# EAGLE design DP_eDP_Adapter_v1.1 (EAGLE 6.4)

## Sheet 1 of 3
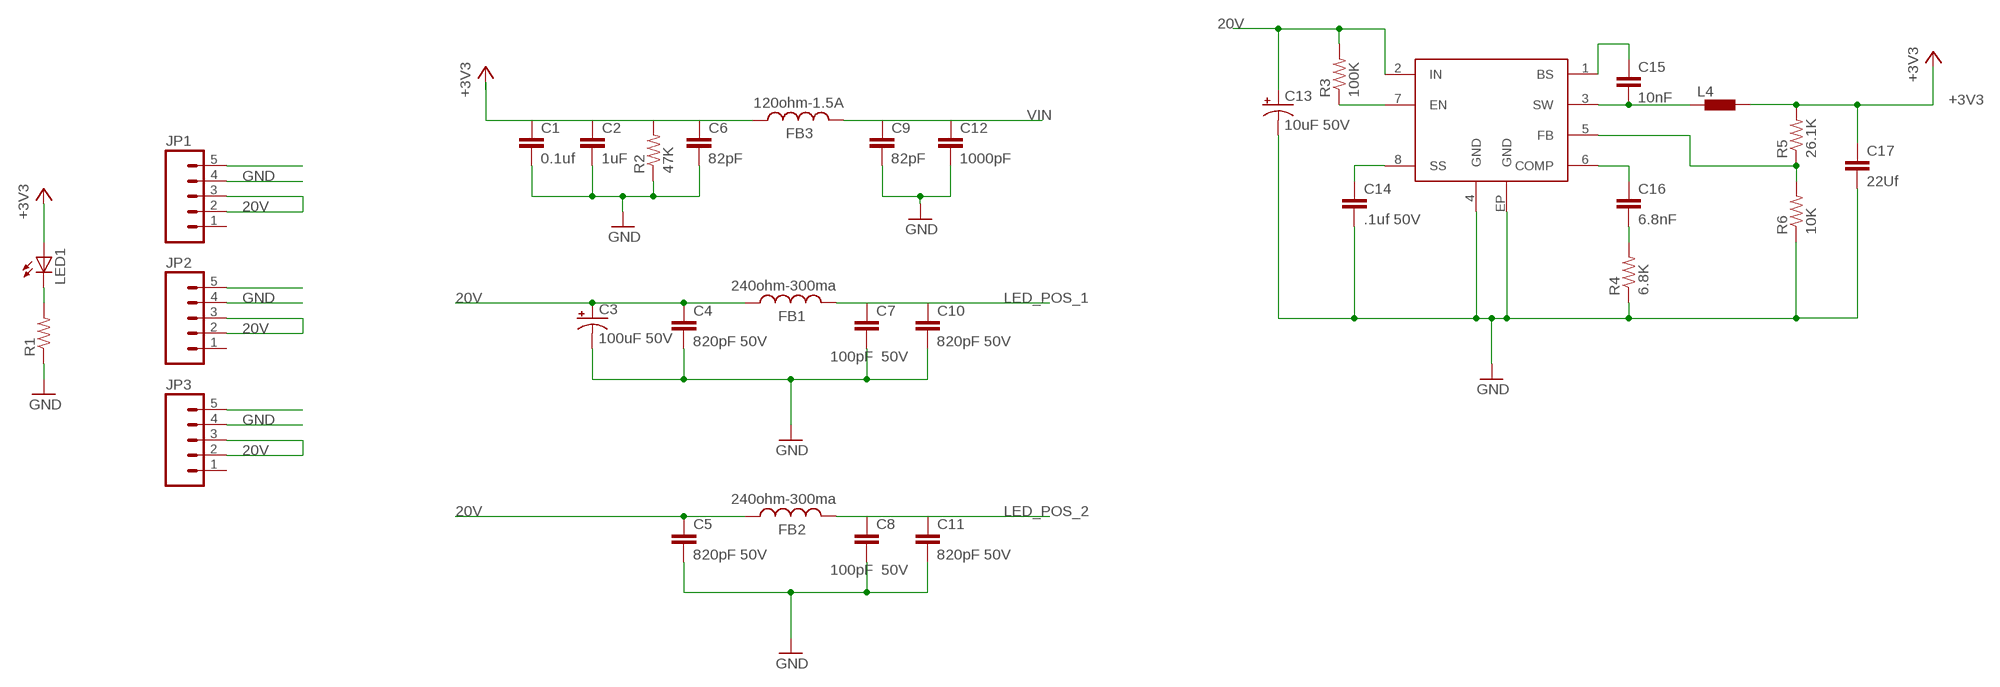
[diagram p0: schematic, sheet 1]

### Parts
C1  0.1uf  CAP0402-CAP  [0402-CAP]
C2  1uF  CAP0402-CAP  [0402-CAP]
C3  100uF 50V  CAP_POL6032  [EIA6032]
C4  820pF 50V  CAP0402-CAP  [0402-CAP]
C5  820pF 50V  CAP0402-CAP  [0402-CAP]
C6  82pF  CAP0402-CAP  [0402-CAP]
C7  100pF 50V  CAP0402-CAP  [0402-CAP]
C8  100pF 50V  CAP0402-CAP  [0402-CAP]
C9  82pF  CAP0402-CAP  [0402-CAP]
C10  820pF 50V  CAP0402-CAP  [0402-CAP]
C11  820pF 50V  CAP0402-CAP  [0402-CAP]
C12  1000pF  CAP0402-CAP  [0402-CAP]
C13  10uF 50V  CAP_POL6032  [EIA6032]
C14  .1uf 50V  CAP0402-CAP  [0402-CAP]
C15  10nF  CAP1206  [1206]
C16  6.8nF  CAP0402-CAP  [0402-CAP]
C17  22Uf  CAP0402-CAP  [0402-CAP]
FB1  240ohm-300ma  L-US  [R0402]
FB2  240ohm-300ma  L-US  [R0402]
FB3  120ohm-1.5A  L-US  [R0402]
IC1  AP6502A  [SO8-EP]
JP1  M05PTH  [1X05]
JP2  M05PTH  [1X05]
JP3  M05PTH  [1X05]
L4  INDUCTORS_DR10300520C  [0520C]
LED1  LED_LEDCHIPLED_1206  [LED_CHIPLED_1206]
R1  RESISTOR0402-RES  [0402-RES]
R2  47K  RESISTOR0402-RES  [0402-RES]
R3  100K  RESISTOR0402-RES  [0402-RES]
R4  6.8K  RESISTOR0402-RES  [0402-RES]
R5  26.1K  RESISTOR0402-RES  [0402-RES]
R6  10K  RESISTOR0402-RES  [0402-RES]

### Nets
20V [Power]: C3.P$1(+) C4.1 C5.1 C13.P$1(+) FB1.1 FB2.1 IC1.2(IN) JP1.2 JP1.3 JP2.2 JP2.3 JP3.2 JP3.3 R3.2
+3V3: C1.1 C2.1 C6.1 C17.1 FB3.1 L4.P$2 LED1.A R2.2 R5.2 ; also sheet 2,3
GND: C1.2 C2.2 C3.P$2(-) C4.2 C5.2 C6.2 C7.2 C8.2 C9.2 C10.2 C11.2 C12.2 C13.P$2(-) C14.2 C17.2 IC1.4(GND) IC1.EP(GND) JP1.4 JP1.5 JP2.4 JP2.5 JP3.4 JP3.5 R1.1 R2.1 R4.1 R6.1 ; also sheet 2,3
LED_POS_1: C7.1 C10.1 FB1.2 ; also sheet 3
LED_POS_2: C8.1 C11.1 FB2.2 ; also sheet 3
N$2: IC1.7(EN) R3.1
N$3: LED1.C R1.2
N$7: C14.1 IC1.8(SS)
N$8: C16.1 IC1.6(COMP)
N$9: C16.2 R4.2
N$10: IC1.5(FB) R5.1 R6.2
N$14: C15.2 IC1.3(SW) L4.P$1
N$18: C15.1 IC1.1(BS)
VIN: C9.1 C12.1 FB3.2 ; also sheet 3
Unconnected: JP1.1 JP2.1 JP3.1

## Sheet 2 of 3
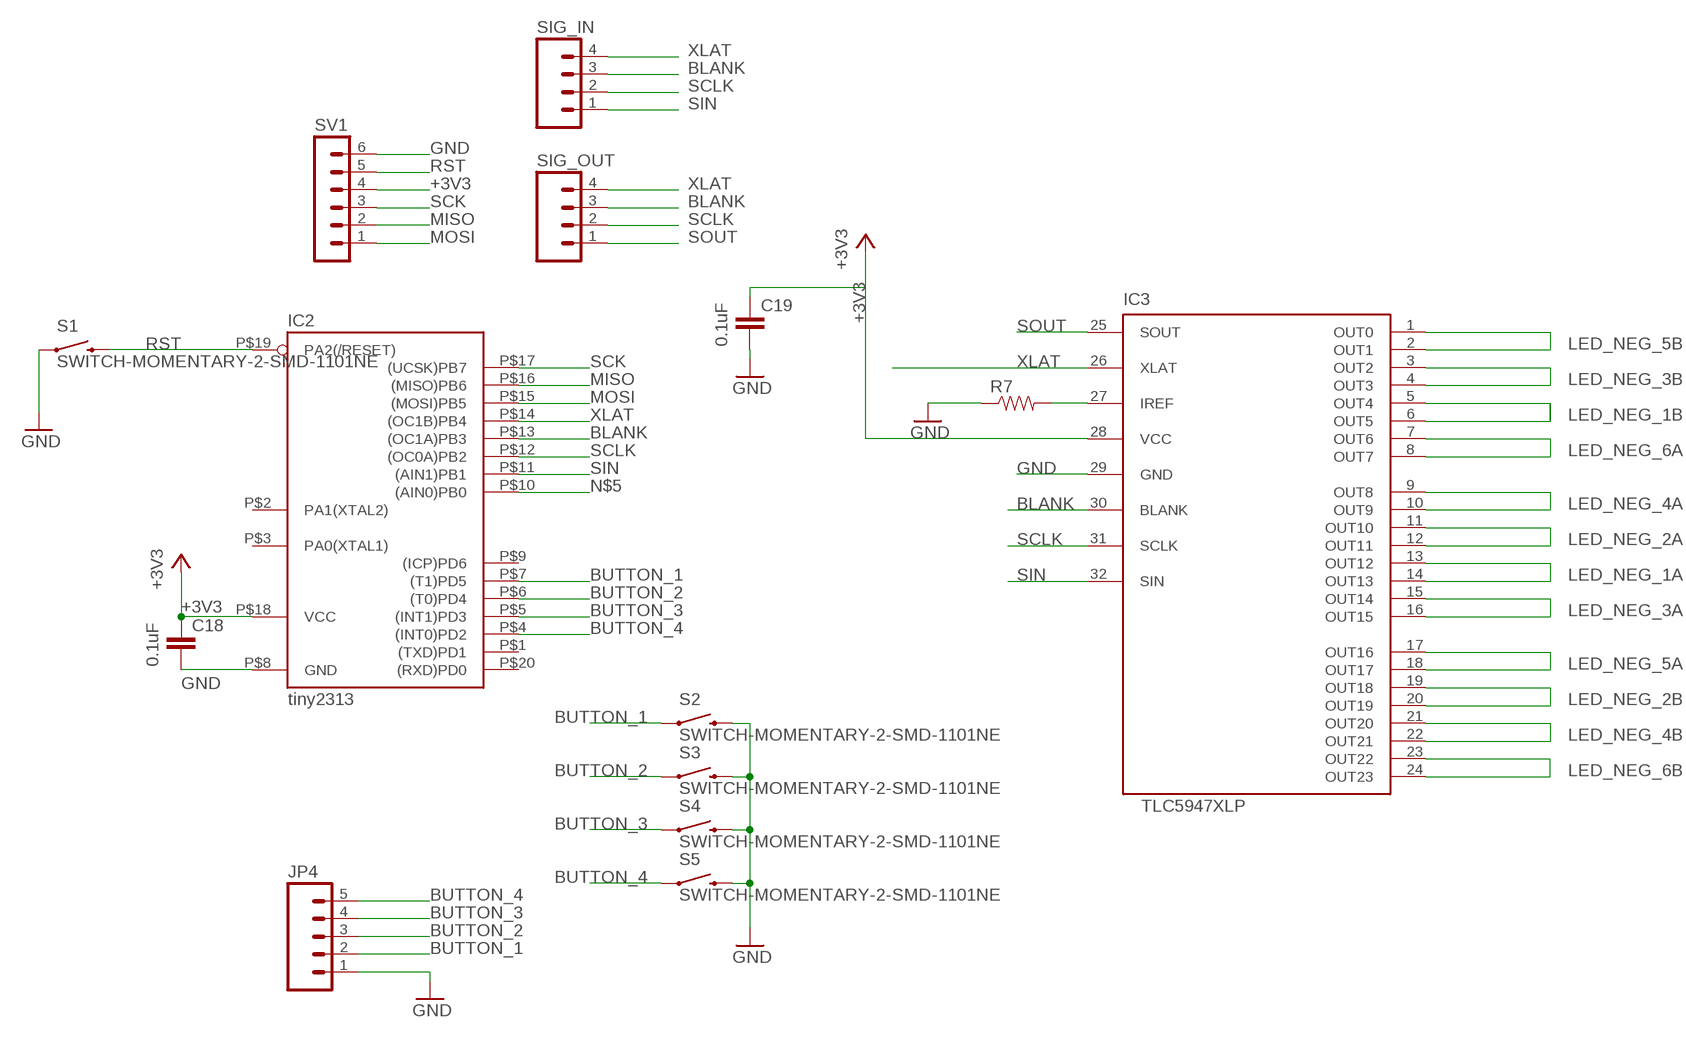
[diagram p1: schematic, sheet 2]

### Parts
C18  0.1uF  CAP0402-CAP  [0402-CAP]
C19  0.1uF  CAP0402-CAP  [0402-CAP]
IC2  tiny2313  TINY2313-*M*  [MLF20]
IC3  TLC5947XLP  [QFN32_XLP]
JP4  M05PTH  [1X05]
R7  RESISTOR0402-RES  [0402-RES]
S1  SWITCH-MOMENTARY-2-SMD-1101NE  [TACTILE-SWITCH-1101NE]
S2  SWITCH-MOMENTARY-2-SMD-1101NE  [TACTILE-SWITCH-1101NE]
S3  SWITCH-MOMENTARY-2-SMD-1101NE  [TACTILE-SWITCH-1101NE]
S4  SWITCH-MOMENTARY-2-SMD-1101NE  [TACTILE-SWITCH-1101NE]
S5  SWITCH-MOMENTARY-2-SMD-1101NE  [TACTILE-SWITCH-1101NE]
SIG_IN  M04PTH  [1X04]
SIG_OUT  M04PTH  [1X04]
SV1  MA06-1  [MA06-1]

### Nets
+3V3: C18.1 C19.1 IC2.P$18(VCC) IC3.28(VCC) SV1.4 ; also sheet 1,3
BLANK: IC2.P$13((OC1A)PB3) IC3.30(BLANK) SIG_IN.3 SIG_OUT.3
BUTTON_1: IC2.P$7((T1)PD5) JP4.2 S2.P$1
BUTTON_2: IC2.P$6((T0)PD4) JP4.3 S3.P$1
BUTTON_3: IC2.P$5((INT1)PD3) JP4.4 S4.P$1
BUTTON_4: IC2.P$4((INT0)PD2) JP4.5 S5.P$1
GND: C18.2 C19.2 IC2.P$8(GND) IC3.29(GND) JP4.1 R7.1 S1.P$1 S2.P$2 S3.P$2 S4.P$2 S5.P$2 SV1.6 ; also sheet 1,3
LED_NEG_1A: IC3.13(OUT12) IC3.14(OUT13) ; also sheet 3
LED_NEG_1B: IC3.5(OUT4) IC3.6(OUT5) ; also sheet 3
LED_NEG_2A: IC3.11(OUT10) IC3.12(OUT11) ; also sheet 3
LED_NEG_2B: IC3.19(OUT18) IC3.20(OUT19) ; also sheet 3
LED_NEG_3A: IC3.15(OUT14) IC3.16(OUT15) ; also sheet 3
LED_NEG_3B: IC3.3(OUT2) IC3.4(OUT3) ; also sheet 3
LED_NEG_4A: IC3.9(OUT8) IC3.10(OUT9) ; also sheet 3
LED_NEG_4B: IC3.21(OUT20) IC3.22(OUT21) ; also sheet 3
LED_NEG_5A: IC3.17(OUT16) IC3.18(OUT17) ; also sheet 3
LED_NEG_5B: IC3.1(OUT0) IC3.2(OUT1) ; also sheet 3
LED_NEG_6A: IC3.7(OUT6) IC3.8(OUT7) ; also sheet 3
LED_NEG_6B: IC3.23(OUT22) IC3.24(OUT23) ; also sheet 3
MISO: IC2.P$16((MISO)PB6) SV1.2
MOSI: IC2.P$15((MOSI)PB5) SV1.1
N$5: IC2.P$10((AIN0)PB0)
N$13: IC3.27(IREF) R7.2
RST: IC2.P$19(PA2(/RESET)) S1.P$2 SV1.5
SCK: IC2.P$17((UCSK)PB7) SV1.3
SCLK: IC2.P$12((OC0A)PB2) IC3.31(SCLK) SIG_IN.2 SIG_OUT.2
SIN: IC2.P$11((AIN1)PB1) IC3.32(SIN) SIG_IN.1
SOUT: IC3.25(SOUT) SIG_OUT.1
XLAT: IC2.P$14((OC1B)PB4) IC3.26(XLAT) SIG_IN.4 SIG_OUT.4
Unconnected: IC2.P$1((TXD)PD1) IC2.P$2(PA1(XTAL2)) IC2.P$3(PA0(XTAL1)) IC2.P$9((ICP)PD6) IC2.P$20((RXD)PD0)

## Sheet 3 of 3
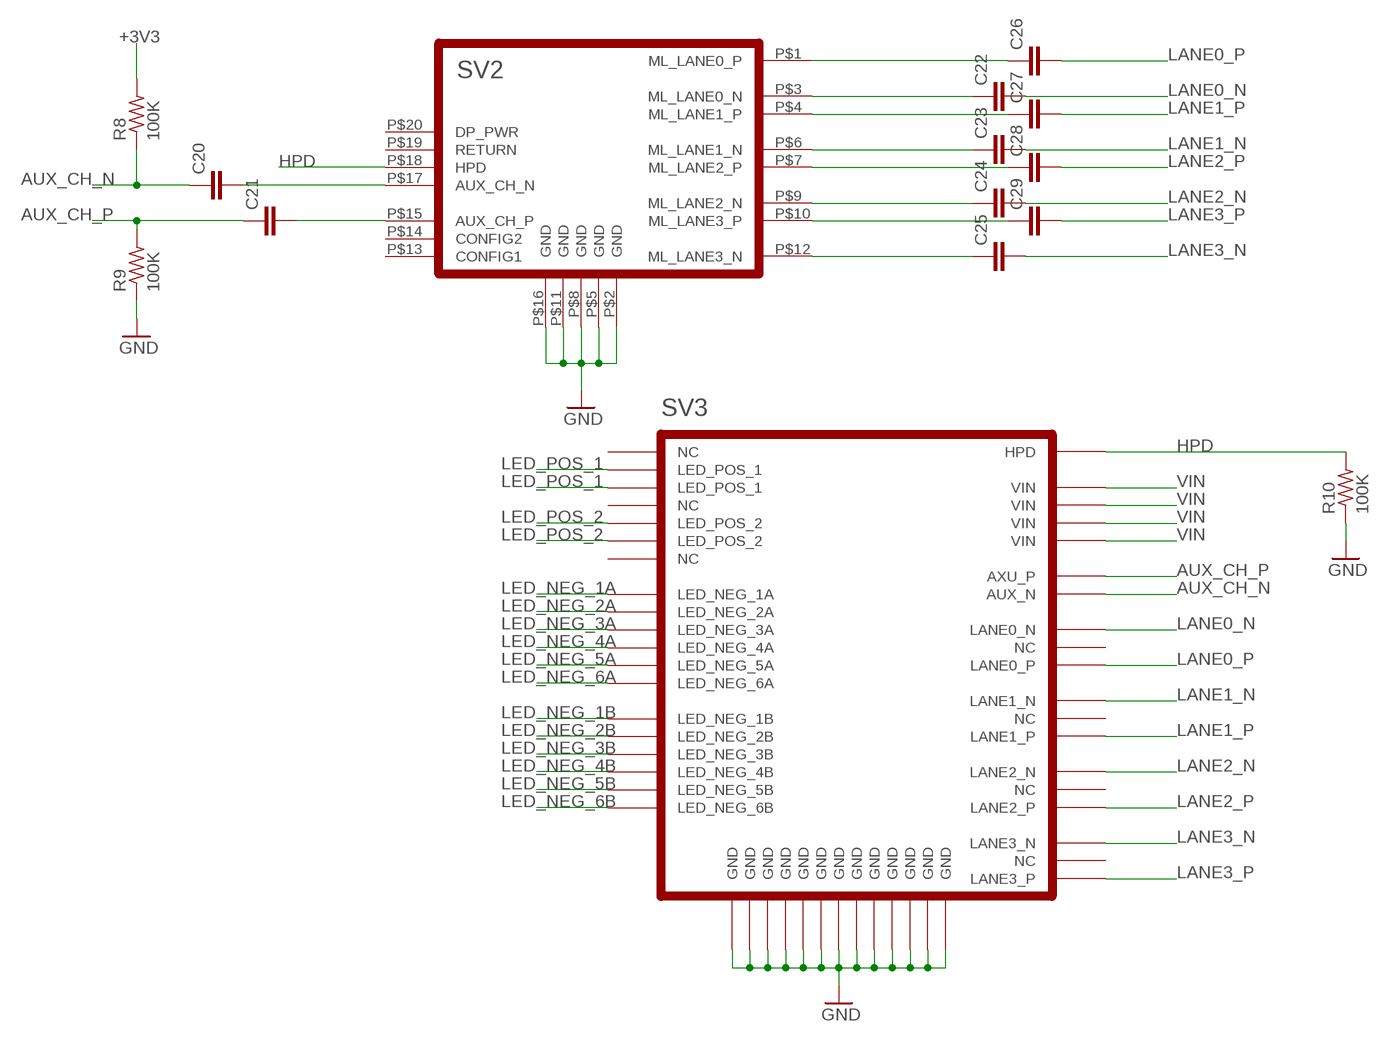
[diagram p2: schematic, sheet 3]

### Parts
C20  SPARKFUN-PASSIVES_CAP0402-CAP  [SPARKFUN-PASSIVES_0402-CAP]
C21  SPARKFUN-PASSIVES_CAP0402-CAP  [SPARKFUN-PASSIVES_0402-CAP]
C22  SPARKFUN-PASSIVES_CAP0402-CAP  [SPARKFUN-PASSIVES_0402-CAP]
C23  SPARKFUN-PASSIVES_CAP0402-CAP  [SPARKFUN-PASSIVES_0402-CAP]
C24  SPARKFUN-PASSIVES_CAP0402-CAP  [SPARKFUN-PASSIVES_0402-CAP]
C25  SPARKFUN-PASSIVES_CAP0402-CAP  [SPARKFUN-PASSIVES_0402-CAP]
C26  SPARKFUN-PASSIVES_CAP0402-CAP  [SPARKFUN-PASSIVES_0402-CAP]
C27  SPARKFUN-PASSIVES_CAP0402-CAP  [SPARKFUN-PASSIVES_0402-CAP]
C28  SPARKFUN-PASSIVES_CAP0402-CAP  [SPARKFUN-PASSIVES_0402-CAP]
C29  SPARKFUN-PASSIVES_CAP0402-CAP  [SPARKFUN-PASSIVES_0402-CAP]
R8  100K  R-US_R0402  [R0402]
R9  100K  R-US_R0402  [R0402]
R10  100K  R-US_R0402  [R0402]
SV2  DP1RD20JQ2R400  [DP_REVERSE_JAE]
SV3  DP_EDP_ADAPTER_EDP_CONNECTOR  [DP_EDP_ADAPTER_EDP_MOLEX]

### Nets
+3V3: R8.2 ; also sheet 1,2
AUX_CH_N: C20.1 R8.1 SV3.P$10(AUX_N)
AUX_CH_P: C21.1 R9.2 SV3.P$9(AXU_P)
AUX_N: C20.2 SV2.P$17(AUX_CH_N)
AUX_P: C21.2 SV2.P$15(AUX_CH_P)
GND: R9.1 R10.1 SV2.P$2(GND) SV2.P$5(GND) SV2.P$8(GND) SV2.P$11(GND) SV2.P$16(GND) SV3.P$1(GND) SV3.P$3(GND) SV3.P$8(GND) SV3.P$11(GND) SV3.P$15(GND) SV3.P$19(GND) SV3.P$23(GND) SV3.P$27(GND) SV3.P$28(GND) SV3.P$29(GND) SV3.P$36(GND) SV3.P$43(GND) SV3.P$51(GND) ; also sheet 1,2
HPD: R10.2 SV2.P$18(HPD) SV3.P$2(HPD)
LANE0_N: C22.2 SV3.P$12(LANE0_N)
LANE0_P: C26.2 SV3.P$14(LANE0_P)
LANE1_N: C23.2 SV3.P$16(LANE1_N)
LANE1_P: C27.2 SV3.P$18(LANE1_P)
LANE2_N: C24.2 SV3.P$20(LANE2_N)
LANE2_P: C28.2 SV3.P$22(LANE2_P)
LANE3_N [DP]: C25.2 SV3.P$24(LANE3_N)
LANE3_P [DP]: C29.2 SV3.P$26(LANE3_P)
LED_NEG_1A: SV3.P$42(LED_NEG_1A) ; also sheet 2
LED_NEG_1B: SV3.P$35(LED_NEG_1B) ; also sheet 2
LED_NEG_2A: SV3.P$41(LED_NEG_2A) ; also sheet 2
LED_NEG_2B: SV3.P$34(LED_NEG_2B) ; also sheet 2
LED_NEG_3A: SV3.P$40(LED_NEG_3A) ; also sheet 2
LED_NEG_3B: SV3.P$33(LED_NEG_3B) ; also sheet 2
LED_NEG_4A: SV3.P$39(LED_NEG_4A) ; also sheet 2
LED_NEG_4B: SV3.P$32(LED_NEG_4B) ; also sheet 2
LED_NEG_5A: SV3.P$38(LED_NEG_5A) ; also sheet 2
LED_NEG_5B: SV3.P$31(LED_NEG_5B) ; also sheet 2
LED_NEG_6A: SV3.P$37(LED_NEG_6A) ; also sheet 2
LED_NEG_6B: SV3.P$30(LED_NEG_6B) ; also sheet 2
LED_POS_1: SV3.P$48(LED_POS_1) SV3.P$49(LED_POS_1) ; also sheet 1
LED_POS_2: SV3.P$45(LED_POS_2) SV3.P$46(LED_POS_2) ; also sheet 1
N$3_N [DP]: C22.1 SV2.P$3(ML_LANE0_N)
N$3_P [DP]: C26.1 SV2.P$1(ML_LANE0_P)
N$15_N [DP]: C23.1 SV2.P$6(ML_LANE1_N)
N$15_P [DP]: C27.1 SV2.P$4(ML_LANE1_P)
N$17_N [DP]: C24.1 SV2.P$9(ML_LANE2_N)
N$17_P [DP]: C28.1 SV2.P$7(ML_LANE2_P)
N$19_N [DP]: C25.1 SV2.P$12(ML_LANE3_N)
N$19_P [DP]: C29.1 SV2.P$10(ML_LANE3_P)
VIN: SV3.P$4(VIN) SV3.P$5(VIN) SV3.P$6(VIN) SV3.P$7(VIN) ; also sheet 1
Unconnected: SV2.P$13(CONFIG1) SV2.P$14(CONFIG2) SV2.P$19(RETURN) SV2.P$20(DP_PWR) SV3.P$13(NC) SV3.P$17(NC) SV3.P$21(NC) SV3.P$25(NC) SV3.P$44(NC) SV3.P$47(NC) SV3.P$50(NC)

## Library data of the parts
C1 C2 C4-C12 C14-C17 = SparkFun-Passives:CAP: Capacitor Standard 0603 ceramic capacitor, and 0.1" leaded capacitor.
C3 C13 = SparkFun-Passives:CAP_POL: Capacitor Polarized These are standard SMD and PTH capacitors. Normally 10uF, 47uF, and 100uF in electrolytic and tantalum varieties. Always verify the external diameter of the through hole cap, it varies with capacity, voltage, and manufacturer. The EIA devices should be standard.
C18 C19 = SparkFun:CAP: Capacitor Standard 0603 ceramic capacitor, and 0.1" leaded capacitor.
C20-C29 = DP_eDP_Adapter:SPARKFUN-PASSIVES_CAP: Capacitor Standard 0603 ceramic capacitor, and 0.1" leaded capacitor.
FB1-FB3 = rcl:L-US: INDUCTOR, American symbol
IC1 = DP_eDP_Adapter:AP6502A
IC2 = NSL_Cylon:TINY2313*: Atmel Tiny2313 2K Flash, 128 bytes EEPROM, 128 bytes RAM
IC3 = slice_noshift:TLC5947
JP1-JP4 = SparkFun-Connectors:M05: Header 5 Standard 5-pin 0.1" header. Use with straight break away headers (SKU : PRT-00116), right angle break away headers (PRT-00553), swiss pins (PRT-00743), machine pins (PRT-00117), and female headers (PRT-00115). Molex polarized connector foot print use with SKU : PRT-08230 with associated crimp pins and housings.
L4 = DP_eDP_Adapter_v1.1:INDUCTORS_DR1030: DR1030 Series Low Profile Power Inductors Source: Data sheet <http://www.cooperbussmann.com/pdf/c73e479f-f867-4c64-ae26-9c1f23814163.pdf>
LED1 = badge.lbrbadge_2013:LED_LED: LED OSRAM: - CHIPLED LG R971, LG N971, LY N971, LG Q971, LY Q971, LO R971, LY R971 LH N974, LH R974 LS Q976, LO Q976, LY Q976 LO Q996 - Hyper CHIPLED LW Q18S LB Q993, LB Q99A, LB R99A - SideLED LS A670, LO A670, LY A670, LG A670, LP A670 LB A673, LV A673, LT A673, LW A673 LH A674 LY A675 LS A676, LA A676, LO A676, LY A676, LW A676 LS A679, LY A679, LG A679 - Hyper Micro SIDELED® LS Y876, LA Y876, LO Y876, LY Y876 LT Y87S - SmartLED LW L88C, LW L88S LB L89C, LB L89S, LG L890 LS L89K, LO L89K, LY L89K LS L896, LA L896, LO L896, LY L896 - TOPLED LS T670, LO T670, LY T670, LG T670, LP T670 LSG T670, LSP T670, LSY T670, LOP T670, LYG T670 LG T671, LOG T671, LSG T671 LB T673, LV T673, LT T673, LW T673 LH T674 LS T676, LA T676, LO T676, LY T676, LB T676, LH T676, LSB T676, LW T676 LB T67C, LV T67C, LT T67C, LS T67K, LO T67K, LY T67K, LW E67C LS E67B, LA E67B, LO E67B, LY E67B, LB E67C, LV E67C, LT E67C LW T67C LS T679, LY T679, LG T679 LS T770, LO T770, LY T770, LG T770, LP T770 LB T773, LV T773, LT T773, LW T773 LH T774 LS E675, LA E675, LY E675, LS T675 LS T776, LA T776, LO T776, LY T776, LB T776 LHGB T686 LT T68C, LB T68C - Hyper Mini TOPLED® LB M676 - Mini TOPLED Santana® LG M470 LS M47K, LO M47K, LY M47K Source: http://www.osram.convergy.de LUXEON: - LUMILED® LXK2-PW12-R00, LXK2-PW12-S00, LXK2-PW14-U00, LXK2-PW14-V00 LXK2-PM12-R00, LXK2-PM12-S00, LXK2-PM14-U00 LXK2-PE12-Q00, LXK2-PE12-R00, LXK2-PE12-S00, LXK2-PE14-T00, LXK2-PE14-U00 LXK2-PB12-K00, LXK2-PB12-L00, LXK2-PB12-M00, LXK2-PB14-N00, LXK2-PB14-P00, LXK2-PB14-Q00 LXK2-PR12-L00, LXK2-PR12-M00, LXK2-PR14-Q00, LXK2-PR14-R00 LXK2-PD12-Q00, LXK2-PD12-R00, LXK2-PD12-S00 LXK2-PH12-R00, LXK2-PH12-S00 LXK2-PL12-P00, LXK2-PL12-Q00, LXK2-PL12-R00 Source: www.luxeon.com KINGBRIGHT: KA-3528ASYC Source: www.kingbright.com
R1-R7 = SparkFun-Passives:RESISTOR: Resistor Basic schematic elements and footprints for 0603, 1206, and PTH resistors.
R8-R10 = rcl:R-US_: RESISTOR, American symbol
S1-S5 = SparkFun-Electromechanical:SWITCH-MOMENTARY-2: Various NO switches- pushbuttons, reed, etc
SIG_IN SIG_OUT = SparkFun-Connectors:M04: Header 4 Standard 4-pin 0.1" header. Use with straight break away headers (SKU : PRT-00116), right angle break away headers (PRT-00553), swiss pins (PRT-00743), machine pins (PRT-00117), and female headers (PRT-00115). Molex polarized connector foot print use with SKU : PRT-08231 with associated crimp pins and housings. 1MM SMD Version SKU: PRT-10208
SV1 = NSL:MA06-1: PIN HEADER
SV2 = DP_eDP_Adapter:DP1RD20JQ2R400
SV3 = DP_eDP_Adapter:DP_EDP_ADAPTER_EDP_CONNECTOR

## Net classes
0 default: width 0.203 mm
1 DP: width 0.203 mm, drill 0.305 mm, clearance 0.203 mm
2 Power: width 0.305 mm

## Board
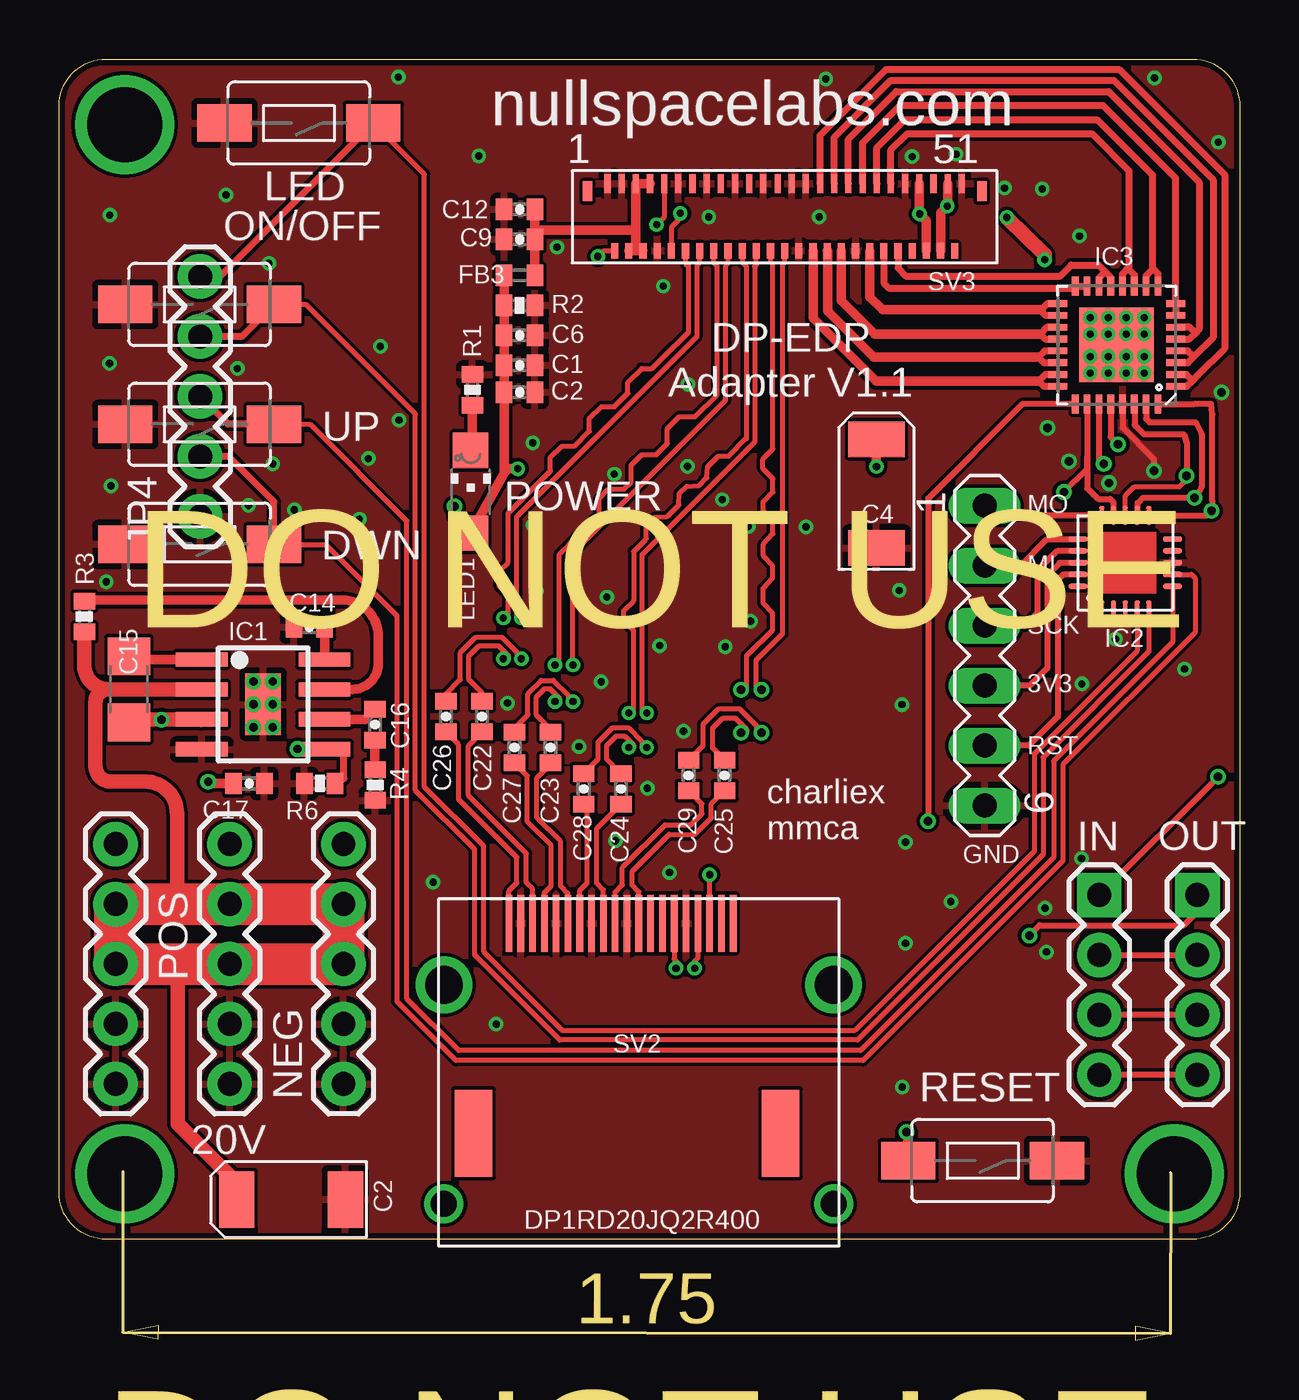
[diagram p3: board, top side]
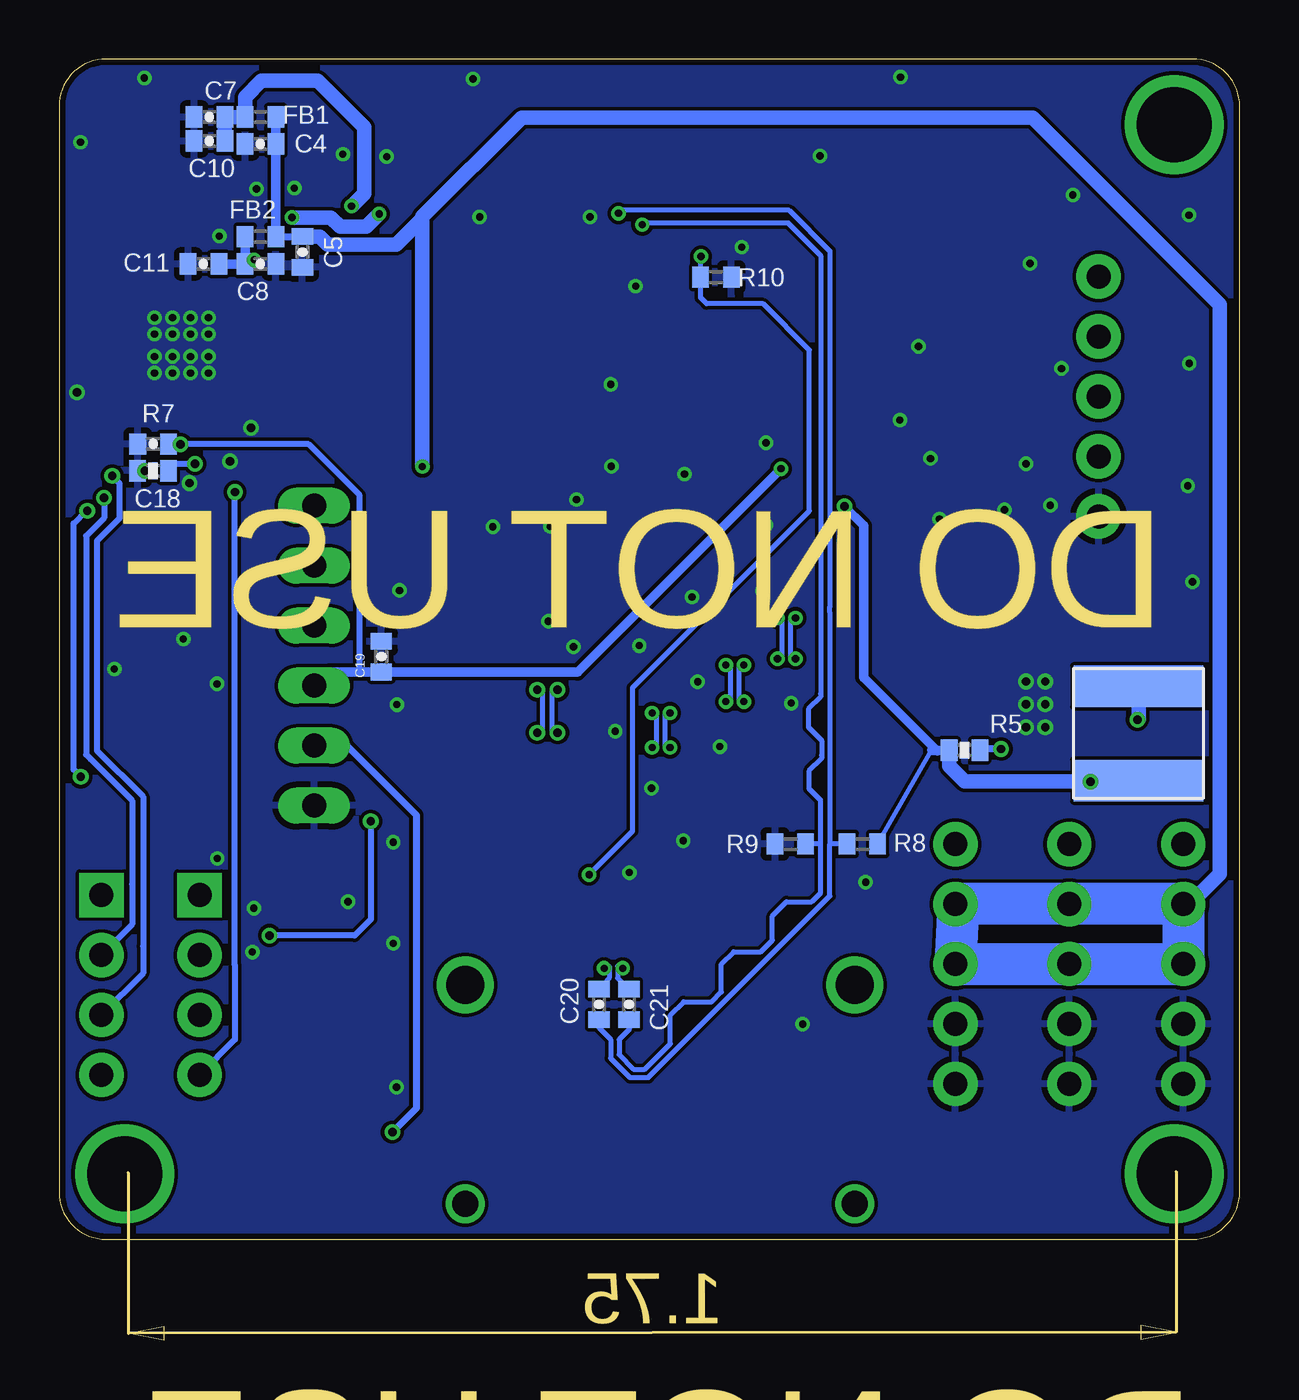
[diagram p4: board, bottom side, seen from below]

Size 50 x 50 mm. Coordinates in mm from the lower left corner, seen from the top.
Outline: 50,48 50,2 arc-90 48,0 2,0 arc-90 0,2 0,48 arc-90 2,50 48,50 arc-90 50,48
Copper layers (1*16): Top 0.035mm / dielectric 1.5mm / Bottom 0.035mm
Design rules "ITEADstudio_DRC *": minimum track width 6mil, minimum drill 12mil, track to track 6mil, track to pad 6mil, pad to pad 6mil, via to via 6mil, smd to smd 0mil, copper to edge 10mil, drill to drill 10mil, minimum pad ring 10mil, minimum via ring 6mil, stop-mask expansion 2mil, vias tented up to drill 20mil, thermal gap 10mil

### Footprints (pad centres in the part's own frame; a part is rotated, then mirrored left to right if it is on the bottom)
0402-CAP = smd 0.7 x 0.9: 1 -0.65,0; 2 0.65,0
EIA6032 = smd 1.5 x 2.4: P$1 -2.3,0; P$2 2.3,0
1206 = smd 1.6 x 1.8: 1 -1.4,0; 2 1.4,0
SPARKFUN-PASSIVES_0402-CAP = smd 0.7 x 0.9: 1 -0.65,0; 2 0.65,0
R0402 = smd 0.7 x 0.9: 1 -0.65,0; 2 0.65,0
SO8-EP = smd 2.2 x 0.6: 1 -2.6,1.905; 2 -2.6,0.635; 3 -2.6,-0.635; 4 -2.6,-1.905; 5 2.6,-1.905; 6 2.6,-0.635; 7 2.6,0.635; 8 2.6,1.905 | smd 1.505 x 2.613: EP 0,0
MLF20 = smd 0.8 x 0.23: P$1 -2,1; P$2 -2,0.5; P$3 -2,0; P$4 -2,-0.5; P$5 -2,-1; P$11 2,-1; P$12 2,-0.5; P$13 2,0; P$14 2,0.5; P$15 2,1 | smd 0.23 x 0.8: P$6 -1,-2; P$7 -0.5,-2; P$8 0,-2; P$9 0.5,-2; P$10 1,-2; P$16 1,2; P$17 0.5,2; P$18 0,2; P$19 -0.5,2; P$20 -1,2
QFN32_XLP = smd 0.285 x 0.8: 1 -1.75,-2.5; 2 -1.25,-2.5; 3 -0.75,-2.5; 4 -0.25,-2.5; 5 0.25,-2.5; 6 0.75,-2.5; 7 1.25,-2.5; 8 1.75,-2.5; 17 1.75,2.5; 18 1.25,2.5; 19 0.75,2.5; 20 0.25,2.5; 21 -0.25,2.5; 22 -0.75,2.5; 23 -1.25,2.5; 24 -1.75,2.5 | smd 0.8 x 0.285: 9 2.5,-1.75; 10 2.5,-1.25; 11 2.5,-0.75; 12 2.5,-0.25; 13 2.5,0.25; 14 2.5,0.75; 15 2.5,1.25; 16 2.5,1.75; 25 -2.5,1.75; 26 -2.5,1.25; 27 -2.5,0.75; 28 -2.5,0.25; 29 -2.5,-0.25; 30 -2.5,-0.75; 31 -2.5,-1.25; 32 -2.5,-1.75 | smd 3.15 x 3.15: EP 0,0
1X05 = drill 1.016 pad 1.88: 1 0,0; 2 2.54,0; 3 5.08,0; 4 7.62,0; 5 10.16,0
0520C = smd 1.75 x 5.5: P$1 -2,0; P$2 2,0
LED_CHIPLED_1206 = smd 1.5 x 1.5: A 0,-1.75; C 0,1.75
0402-RES = smd 0.7 x 0.9: 1 -0.65,0; 2 0.65,0
TACTILE-SWITCH-1101NE = smd 2.3 x 1.6: P$1 -3.15,0; P$2 3.15,0
1X04 = drill 1.016 pad 1.88 square: 1 0,0 | drill 1.016 pad 1.88: 2 2.54,0; 3 5.08,0; 4 7.62,0
MA06-1 = drill 1.016 long: 1 -6.35,0; 2 -3.81,0; 3 -1.27,0; 4 1.27,0; 5 3.81,0; 6 6.35,0
DP_REVERSE_JAE = smd 0.28 x 2.4: P$1 -5.5,0; P$2 -5,0; P$3 -4.5,0; P$4 -4,0; P$5 -3.5,0; P$6 -3,0; P$7 -2.5,0; P$8 -2,0; P$9 -1.5,0; P$10 -1,0; P$11 -0.5,0; P$12 0,0; P$13 0.5,0; P$14 1,0; P$15 1.5,0; P$16 2,0; P$17 2.5,0; P$18 3,0; P$19 3.5,0; P$20 4,0 | drill 1.6: P$22 8.25,-2.6; P$23 -8.25,-2.6 | smd 1.6 x 3.7: P$24 -7,-8.89; P$25 6,-8.89 | drill 1.1: P$26 -8.25,-11.88; P$27 8.25,-11.88
DP_EDP_ADAPTER_EDP_MOLEX = smd 0.26 x 0.8: P$1 7.5,-1.08; P$3 6.9,-1.08; P$5 6.3,-1.08; P$7 5.7,-1.08; P$9 5.1,-1.08; P$11 4.5,-1.08; P$13 3.9,-1.08; P$15 3.3,-1.08; P$17 2.7,-1.08; P$19 2.1,-1.08; P$21 1.5,-1.08; P$23 0.9,-1.08; P$25 0.3,-1.08; P$27 -0.3,-1.08; P$29 -0.9,-1.08; P$31 -1.5,-1.08; P$33 -2.1,-1.08; P$35 -2.7,-1.08; P$37 -3.3,-1.08; P$39 -3.9,-1.08; P$41 -4.5,-1.08; P$43 -5.1,-1.08; P$45 -5.7,-1.08; P$47 -6.3,-1.08; P$49 -6.9,-1.08; P$51 -7.5,-1.08 | smd 0.3 x 0.65: P$2 7.2,1.77; P$4 6.6,1.77; P$6 6,1.77; P$8 5.4,1.77; P$10 4.8,1.77; P$12 4.2,1.77; P$14 3.6,1.77; P$16 3,1.77; P$18 2.4,1.77; P$20 1.8,1.77; P$22 1.2,1.77; P$24 0.6,1.77; P$26 0,1.77; P$28 -0.6,1.77; P$30 -1.2,1.77; P$32 -1.8,1.77; P$34 -2.4,1.77; P$36 -3,1.77; P$38 -3.6,1.77; P$40 -4.2,1.77; P$42 -4.8,1.77; P$44 -5.4,1.77; P$46 -6,1.77; P$48 -6.6,1.77; P$50 -7.2,1.77 | smd 0.4 x 0.85: P$52 8.35,-0.75; P$53 -8.35,-0.75

### Placement (x,y rotation side)
C1  19.5,37.03 0 top
C2  19.5,35.88 0 top
C3  34.61,31.59 270 top
C4  41.47,46.4 180 bottom
C5  39.69,41.83 270 bottom
C6  19.5,38.3 0 top
C7  43.63,47.54 180 bottom
C8  41.47,41.32 0 bottom
C9  19.5,42.36 180 top
C10  43.63,46.53 180 bottom
C11  43.88,41.32 180 bottom
C12  19.5,43.63 180 top
C13  9.82,1.69 0 top
C14  10.6,25.94 180 top
C15  2.95,23.3 270 top
C16  13.38,21.8 270 top
C17  8.05,19.31 0 top
C18  46.02,33.69 180 bottom
C19  36.35,24.68 90 bottom
C20  27.13,9.95 90 bottom
C21  25.86,9.95 90 bottom
C22  17.91,22.14 90 top
C23  20.81,20.83 90 top
C24  23.79,19.08 90 top
C25  28.19,19.65 90 top
C26  16.39,22.14 90 top
C27  19.29,20.83 90 top
C28  22.22,19.08 90 top
C29  26.66,19.65 90 top
FB1  41.47,47.54 180 bottom
FB2  41.47,42.48 180 bottom
FB3  19.5,40.84 0 top
IC1  8.64,22.66 0 top
IC2  45.15,28.66 90 top
IC3  44.78,37.89 90 top
JP1  2.39,16.74 270 top
JP2  7.22,16.74 270 top
JP3  12.05,16.74 270 top
JP4  5.98,30.63 90 top
L4  4.29,21.43 270 bottom
LED1  17.43,31.67 0 top
R1  17.51,35.99 270 top
R2  19.5,39.57 180 top
R3  1.07,26.38 270 top
R4  13.39,19.25 90 top
R5  11.65,20.72 180 bottom
R6  11.04,19.31 0 top
R7  46.02,32.56 0 bottom
R8  15.98,16.74 0 bottom
R9  19.03,16.74 0 bottom
R10  22.18,40.76 180 bottom
S1  39.11,3.33 180 top
S2  5.95,29.45 180 top
S3  5.95,34.52 180 top
S4  5.95,39.61 180 top
S5  10.15,47.29 180 top
SIG_IN  44.05,14.59 270 top
SIG_OUT  48.2,14.59 270 top
SV1  39.2,24.73 270 top
SV2  24.55,13.38 0 top
SV3  30.73,43.64 180 top

### Tracks (layer width: path | path; a pad name or v marks a point on that pad's centre or on a via)
20V  (via drill 0.3)
  Top 0.305: 4.98,18.08 arc90 5.01,18.05
  Top 0.406: 7.52,2.4 C13.P$1 | 2.37,11.69 JP1.3 | C3.P$1 v34.61,32.73
  Top 0.61: 5.2,14.22 5.12,14.22 4.43,14.22 4.43,14.21 7.8,14.21 | 5.04,11.66 5.04,4.89 7.52,2.4 | 5.01,18.05 5.01,14.48 arc90 5.2,14.29 | 4.98,18.08 arc90 3.68,19.39 2.19,19.39 arc-90 1.54,20.03 1.54,22.75 arc-90 2.09,23.3 | 2.09,23.3 IC1.2 | R3.2 1.07,24.31 arc90 2.09,23.3
  Top 1.016: 5.2,14.29 5.12,14.22
  Top 1.778: JP1.2 JP2.2 7.8,14.21 JP3.2 JP3.3 JP2.3 5.04,11.66 JP1.3 | 2.37,14.18 2.37,11.69
  Bottom 0.305: FB2.1 C5.1
  Bottom 0.406: FB1.1 C4.1 FB2.1 | 2.36,14.22 2.38,14.22 JP1.2 | 34.61,43.31 34.62,43.31 34.62,43.23
  Bottom 0.61: 40.81,47.56 FB1.1 40.82,47.55 | JP1.2 2.13,14.21 0.84,15.49 0.84,39.59 8.77,47.52 30.41,47.52 34.61,43.31 v34.61,32.73 | 34.62,43.23 35.72,42.13 38.61,42.13 38.96,42.48 C5.1
  Bottom 1.778: 2.36,14.22 11.93,14.22 11.93,14.18 11.92,14.18 JP3.3 JP1.3 2.38,14.14
+3V3  (via drill 0.3, 0.36)
  Top 0.254: IC3.28 44.53,33.99 v44.85,33.67 | IC2.P$18 43.14,28.66 42.37,28.66 41.85,28.14 41.85,24.2 41.11,23.46 SV1.4
  Top 0.406: FB3.1 R2.2 C6.1 C1.1 C2.1 18.85,32.45 | 18.85,32.45 LED1.A 16.74,30.6 v16.74,31.05 | 18.85,32.45 19.04,32.64 v19.43,32.64 | C17.1 6.39,19.31 arc-90 v6.32,19.39
  Bottom 0.203: R8.2 13.03,20.72 R5.2
  Bottom 0.254: C18.1 45.35,33.67 v44.85,33.67 44.84,33.69 39.43,33.69 37.27,31.53 37.27,24.02
  Bottom 0.406: 13.03,20.72 13.02,20.71 | 13.02,20.71 12.29,20.71 | 13.02,20.71 12.81,20.68 15.93,23.81 15.93,30.23 v16.74,31.05 | v19.43,32.64 28.04,24.03 C19.1 | C19.1 38.62,24.03 SV1.4 | 37.27,24.02 36.36,24.02 C19.1 | 4.33,19.39 arc-90 L4.P$2
  Bottom 0.61: R5.2 12.31,20.71 12.31,20.05 11.65,19.39 v6.32,19.39 4.33,19.39 | 4.33,19.39 arc-90 L4.P$2 arc90 4.33,19.39 | 4.33,19.39 arc90 4.43,19.29
AUX_CH_N  (via drill 0.3)
  Top 0.203: v26.31,43.47 26.21,43.36 26.21,43.15 25.93,42.87 SV3.P$10
  Bottom 0.203: C20.1 27.13,8.96 26.64,8.46 26.64,7.67 25.82,6.85 25.04,6.85 17.36,14.54 17.36,16.74 | v26.31,43.47 26.18,43.59 19.08,43.59 17.36,41.86 17.36,26.8 17.36,26.55 17.36,16.74 | R8.1 16.77,16.88 16.91,16.74 17.36,16.74
AUX_CH_P  (via drill 0.3)
  Top 0.203: SV3.P$9 25.63,43.31 v25.3,42.98
  Bottom 0.203: C21.1 25.86,8.88 26.28,8.46 26.28,7.81 25.68,7.21 25.19,7.21 24.11,8.28 24.11,9.51 23.55,10.06 22.36,10.06 21.95,10.47 21.95,11.66 21.43,12.19 20.28,12.19 19.79,12.67 19.79,13.7 19.2,14.29 18.13,14.29 17.75,14.68 17.75,14.7 17.75,16.77 | 25.15,43.12 v25.3,42.98 25.24,43.05 19.12,43.05 17.75,41.68 17.75,23.12 17.75,22.98 18.27,22.46 18.27,21.7 17.71,21.14 17.71,20.5 17.71,20.36 18.24,19.83 18.24,19.09 17.75,18.6 17.75,16.77 | R9.2 18.36,16.77 17.75,16.77
AUX_N  (via drill 0.3)
  Top 0.203: SV2.P$17 27.05,11.91 26.7,11.56 v26.92,11.48
  Bottom 0.203: v26.92,11.48 26.7,11.56 26.7,11.07 C20.2
AUX_P  (via drill 0.3)
  Top 0.203: SV2.P$15 26.05,11.86 26.35,11.56 v26.13,11.48
  Bottom 0.203: v26.13,11.48 26.35,11.56 26.35,11.07 26.33,11.07 C21.2
BLANK  (via drill 0.36)
  Top 0.203: IC2.P$13 45.15,31.5 45.54,31.88 47.44,31.88 47.75,32.19 v47.75,32.34
  Top 0.254: IC3.30 45.55,35.37 45.55,34.5 45.94,34.11 47.62,34.11 47.76,33.7 47.76,32.35 v47.75,32.34 | SIG_OUT.3 SIG_IN.3
  Bottom 0.254: v47.75,32.34 47.44,32.04 47.44,31.11 47.44,30.54 48.39,29.59 48.39,20.71 46.44,18.75 46.44,12.43 46.44,11.27 SIG_OUT.3
BUTTON_1
  Top 0.203: IC2.P$7 47.96,28.16 48.11,28.01 48.11,25.71 42.51,20.11 42.51,16.03 34.05,7.58 16.81,7.58 14.32,10.06 14.32,26.41 11.31,29.42 9.12,29.42 S2.P$1
  Top 0.305: S2.P$1 9.1,31.25 7.18,33.17 JP4.2
BUTTON_2
  Top 0.203: IC2.P$6 47.15,25.3 42.12,20.26 42.12,16.17 33.94,8 16.92,8 14.73,10.19 14.73,30.44 10.65,34.51 9.11,34.51 S3.P$1
  Top 0.305: S3.P$1 7.16,34.52 JP4.3
BUTTON_3
  Top 0.203: IC2.P$5 46.15,24.89 41.67,20.41 41.67,16.3 33.81,8.44 21.2,8.44 17.6,12.05 17.6,16.52 15.09,19.02 15.09,34.97 10.47,39.59 9.11,39.59 S4.P$1
  Top 0.305: S4.P$1 7.74,38.25 JP4.4
BUTTON_4
  Top 0.203: IC2.P$4 45.65,24.92 41.29,20.57 41.29,16.44 33.71,8.86 21.3,8.86 17.96,12.2 17.96,16.68 15.47,19.17 15.47,45.12 14.47,46.12 14.07,46.53 S5.P$1
  Top 0.305: S5.P$1 6.8,40.79 JP4.5
GND  (via drill 0.3, 0.36)
  Top 0.254: IC3.29 45.03,34.38 46.36,33.05 v46.36,32.56 | SV2.P$8
  other vias: 44.47,32.04 42.77,32.96 41.87,34.37 49.23,35.88 32.47,49.16 20.06,30.26 17.77,45.89 35.58,27.49 7.07,44.24 14.37,49.23 8.24,23.63 9.05,23.63 8.24,21.7 8.24,22.66 9.05,21.7 9.05,22.66 21.09,42.03 36.13,45.87 43.67,39.05 44.43,39.05 45.19,39.05 45.95,39.05 43.67,38.35 44.43,38.35 45.19,38.35 45.95,38.35 27.51,43.31 32.19,43.31 26.61,32.75 28.09,31.34 29.19,30.19 31.63,30.18 25.43,25.15 23.2,27.21 29.28,26.18 28.21,25.1 26.45,21.52 22.02,20.87 18.99,22.71 26.64,36.21 22.96,23.62 20.21,27.48 25.58,40.38 2.15,43.39 13.61,37.83 13.1,33.08 12.72,30.51 9.96,30.91 14.4,34.7 15.84,15.13 18.51,9.11 35.69,22.65 35.85,12.54 37.76,14.31 47.66,24.16 41.75,14.03 43.31,23.53 44.74,25.43 43.3,16.14 41.81,12.17 35.85,16.82 25.85,15.54 23.56,16.88 24.91,19.11 8.88,41.34 7.55,36.89 9.05,32.85 8.02,31.1 2,27.86 37.98,45.97 40.04,44.53 41.64,44.49 43.21,42.5 46.39,49.19 49.09,46.48 43.67,37.4 44.43,37.4 45.19,37.4 45.95,37.4 43.67,36.7 44.43,36.7 45.19,36.7 45.95,36.7 2.14,37.1 2.2,31.92 20.06,33.74 23.51,32.42 35.71,6.45
  pour Top: -0.91,50.91 51.42,50.91 51.42,-0.91 -0.91,-0.91
  pour Bottom: 51.94,51.34 51.94,-1.53 -1.42,-1.47 -1.42,51.4
HPD  (via drill 0.3)
  Top 0.203: SV2.P$18 v27.55,15.45 | v22.82,41.64 23.05,41.87 SV3.P$2
  Bottom 0.203: v27.55,15.45 25.71,17.29 25.71,23.37 18.23,30.86 18.23,37.67 20.19,39.63 22.57,39.63 22.83,39.89 R10.2 22.82,40.78 v22.82,41.64
LANE0_N  (via drill 0.3)
  Top 0.203: C22.2 17.91,23.15 17.36,23.7 17.36,24.71 17.8,25.15 18.6,25.15 19.02,24.74 19.02,24.59 v18.82,24.59 | v18.82,26.32 19.02,26.32 19.02,27.29 18.65,27.65 18.65,28.3 19.02,28.67 19.02,28.95 19.02,30.76 20.81,32.55 20.81,33.13 21.28,33.6 21.84,33.61 22.46,34.23 22.46,34.78 22.95,35.27 23.51,35.27 24.09,35.85 24.09,36.3 24.67,36.89 25.1,36.89 25.5,37.28 25.51,37.28 26.66,38.44 26.66,41.2 | 26.66,41.2 26.66,41.27 | SV3.P$12 26.53,41.34 26.66,41.2
  Bottom 0.203: v18.82,24.59 19.02,24.59 19.02,26.32 v18.82,26.32
LANE0_P  (via drill 0.3)
  Top 0.203: C26.2 16.39,23.09 17,23.7 17,24.86 17.65,25.51 18.75,25.51 19.37,24.88 19.37,24.59 v19.58,24.59 | v19.58,26.32 19.37,26.32 19.37,30.62 27.02,38.26 27.02,41.27 27.13,41.38 SV3.P$14
  Bottom 0.203: v19.58,24.59 19.37,24.59 19.37,26.32 v19.58,26.32
LANE1_N  (via drill 0.3)
  Top 0.203: C23.2 20.81,21.62 20.21,22.22 20.21,22.97 20.57,23.32 20.79,23.32 21.2,22.91 21.2,22.78 v21,22.78 | 21.2,24.33 21.19,24.33 | 21.19,24.33 v21,24.33 | 21.19,24.33 21.19,29.01 21.19,29.03 21.58,29.42 21.6,29.43 21.6,29.45 22.51,30.36 22.87,30.71 22.87,31.39 23.26,31.78 23.92,31.78 24.23,32.09 24.23,32.8 24.38,32.95 24.67,33.24 25.29,33.24 25.76,33.71 25.76,34.35 26.26,34.84 26.93,34.84 27.86,35.77 27.86,41.24 27.73,41.37 SV3.P$16
  Bottom 0.203: v21,22.78 21.2,22.78 21.2,24.33 v21,24.33
LANE1_P  (via drill 0.3)
  Top 0.203: C27.2 19.29,21.65 19.86,22.22 19.86,23.12 20.42,23.68 20.93,23.68 21.56,23.05 21.56,22.78 v21.76,22.78 | 21.56,24.33 v21.76,24.33 21.76,29.08 28.21,35.53 28.21,41.24 28.33,41.36 SV3.P$18
  Bottom 0.203: v21.76,22.78 21.56,22.78 21.56,24.33 v21.76,24.33
LANE2_N  (via drill 0.3)
  Top 0.203: C24.2 23.18,20.34 23.18,20.91 23.59,21.32 23.95,21.32 24.33,20.94 24.33,20.83 v24.12,20.83 | v24.12,22.3 24.33,22.3 24.33,23.96 24.33,25.34 24.33,25.77 23.92,26.18 23.92,26.64 24.33,27.05 24.33,29.14 24.84,29.65 24.87,29.69 24.87,30.22 25.24,30.59 25.76,30.63 26.25,31.11 26.27,31.6 26.56,31.9 27.11,31.93 27.44,32.26 27.46,32.73 27.91,33.18 28.35,33.18 29.09,33.91 29.1,33.91 29.1,41.22 28.93,41.39 SV3.P$20
  Bottom 0.203: v24.12,20.83 24.33,20.83 24.33,22.3 v24.12,22.3
LANE2_P  (via drill 0.3)
  Top 0.203: C28.2 22.83,20.34 22.83,21.06 23.44,21.67 24.1,21.67 24.68,21.09 24.68,20.83 v24.89,20.83 | v24.89,22.3 24.68,22.3 24.68,28.99 29.46,33.77 29.46,41.22 29.53,41.29 SV3.P$22
  Bottom 0.203: v24.89,20.83 24.68,20.83 24.68,22.3 v24.89,22.3
LANE3_N  (via drill 0.36)
  Top 0.203: C25.2 27.68,20.81 27.68,21.65 28.11,22.08 28.64,22.08 29.12,21.6 29.12,21.46 v28.89,21.46 | v28.89,23.27 29.12,23.27 29.12,24.73 30.22,25.81 30.22,25.83 30.22,26.52 29.81,26.96 29.81,27.58 30.22,28.01 30.22,28.54 29.83,28.96 29.83,29.45 30.23,29.89 30.23,30.42 29.81,30.88 29.81,31.24 30.23,31.66 30.23,32.23 29.8,32.66 29.8,33.05 30.23,33.48 30.23,41.31 30.13,41.41 SV3.P$24
  Bottom 0.203: v28.89,21.46 29.12,21.46 29.12,23.27 v28.89,23.27
LANE3_P  (via drill 0.36)
  Top 0.203: C29.2 27.27,20.91 27.27,21.82 27.94,22.48 28.8,22.48 29.52,21.77 29.52,21.46 v29.75,21.46 | v29.75,23.27 29.52,23.27 29.52,24.54 30.64,25.65 30.64,41.31 30.73,41.4 SV3.P$26
  Bottom 0.203: v29.75,21.46 29.52,21.46 29.52,23.27 v29.75,23.27
LED_NEG_1A
  Top 0.305: SV3.P$42 35.53,41.14 35.86,40.81 42.4,40.81 42.86,41.27 44.02,41.27 44.3,40.99 | 44.3,40.99 44.03,40.72 IC3.14 | IC3.13 44.53,40.76 44.3,40.99
LED_NEG_1B
  Top 0.305: SV3.P$35 33.43,46.6 35.45,48.62 44.44,48.62 48.28,44.79 48.28,38.55 48.13,38.4 | 48.13,38.4 47.89,38.63 IC3.6 | IC3.5 47.86,38.13 48.13,38.4
LED_NEG_2A
  Top 0.305: SV3.P$41 35.23,46.15 35.91,46.83 43.75,46.83 45.31,45.27 45.31,41.18 | 45.31,41.18 45.31,41.09 45.53,40.86 IC3.11 | IC3.12 45.03,40.91 45.31,41.18
LED_NEG_2B
  Top 0.305: IC3.20 41.76,38.13 41.55,38.35 41.84,38.63 IC3.19
  Top 0.406: SV3.P$34 33.13,39.77 34.55,38.35 41.55,38.35
LED_NEG_3A
  Top 0.305: IC3.15 IC3.16 42.95,40.3 35.13,40.3 34.93,40.51 SV3.P$40
LED_NEG_3B
  Top 0.305: SV3.P$33 32.83,46.7 35.22,49.09 44.67,49.09 48.88,44.89 48.88,38.21 48.05,37.38 | 48.05,37.38 47.8,37.63 IC3.4 | IC3.3 47.8,37.13 48.05,37.38
LED_NEG_4A
  Top 0.305: SV3.P$39 34.63,46.25 35.81,47.43 43.96,47.43 46.3,45.09 46.3,41.14 46.33,41.11 | 46.33,41.11 46.53,40.91 IC3.9 | IC3.10 46.03,40.81 46.33,41.11
LED_NEG_4B
  Top 0.305: IC3.22 41.71,37.13 41.47,37.37 41.74,37.63 IC3.21
  Top 0.406: SV3.P$32 32.54,41.86 32.54,39.33 34.5,37.37 41.47,37.37
LED_NEG_5A
  Top 0.305: IC3.18 41.78,39.13 41.53,39.38 | IC3.17 41.84,39.63 41.59,39.38 | SV3.P$38
  Top 0.406: 41.59,39.38 41.53,39.38 34.88,39.38 34.34,39.92 SV3.P$38
LED_NEG_5B
  Top 0.305: SV3.P$31 32.23,46.77 35.02,49.56 44.89,49.56 49.36,45.09 49.36,37.74 48.22,36.6 48,36.38 | 48,36.38 47.74,36.63 IC3.2 | IC3.1 47.76,36.13 48,36.38
LED_NEG_6A
  Top 0.305: SV3.P$37 34.03,46.45 35.62,48.04 44.2,48.04 47.28,44.96 IC3.8 IC3.7
LED_NEG_6B
  Top 0.305: IC3.24 41.7,36.13 41.48,36.35 41.77,36.63 IC3.23
  Top 0.406: SV3.P$30 31.93,39.03 34.6,36.35 41.48,36.35
LED_POS_1  (via drill 0.3)
  Top 0.406: SV3.P$49 37.63,43.79 v37.61,43.77 37.33,43.49 SV3.P$48
  Bottom 0.61: C10.1 C7.1 FB1.2 42.12,48.39 41.43,49.08 39.05,49.08 37.08,47.11 37.08,44.3 v37.61,43.77
LED_POS_2  (via drill 0.3)
  Top 0.406: SV3.P$45 36.43,43.45 v36.44,43.44 36.73,43.16 SV3.P$46
  Top 0.61: v40.14,43.29 41.74,41.71 v41.74,41.5
  Bottom 0.406: FB2.2 C8.1 C11.1 | 41.79,41.48 arc90 v41.74,41.5
  Bottom 0.61: C8.1 41.79,41.48 | v36.44,43.44 36.99,42.89 38.09,42.89 38.49,43.29 v40.14,43.29
MISO
  Top 0.254: IC2.P$16 43.12,29.64 41.81,29.64 40.72,28.54 SV1.2
MOSI
  Top 0.254: IC2.P$15 39.61,30.66 SV1.1
N$1  (via drill 3.17)
  other vias: 47.23,2.77
N$2
  Top 0.406: IC1.7 12.43,23.3 arc90 13.52,24.39 13.52,25.56 arc90 11.99,27.08 1.48,27.08 arc90 R3.1
N$3
  Top 0.406: R1.2 17.51,33.49 LED1.C
N$3_N
  Top 0.203: SV2.P$3 20.05,14.84 19.79,15.09 19.79,16.35 17.33,18.81 17.33,20.91 C22.1
N$3_P
  Top 0.203: SV2.P$1 19.05,14.76 19.39,15.09 19.39,16.18 16.92,18.64 16.92,20.96 C26.1
N$4  (via drill 3.17)
  other vias: 2.77,47.23
N$6  (via drill 3.17)
  other vias: 2.77,2.77
N$7
  Top 0.406: C14.1 IC1.8
N$8
  Top 0.406: IC1.6 12.96,22.03 C16.1
N$9
  Top 0.406: C16.2 R4.2
N$10  (via drill 0.36)
  Top 0.305: v10.1,20.77 10.12,20.76 IC1.5 12.05,20.76 12.06,20.77 12.06,19.52 R6.2
  Bottom 0.305: v10.1,20.77 10.95,20.77 R5.1
N$13  (via drill 0.36)
  Top 0.254: IC3.27 44.03,33.05 v44.24,32.85
  Bottom 0.254: v44.24,32.85 45.08,32.85 R7.2
N$14  (via drill 0.36)
  Top 0.305: 6.02,22 IC1.3
  Top 0.61: C15.2 arc-90 3.07,22.02 v4.34,22.02 6,22.02 arc-90 6.02,22
  Bottom 0.61: v4.34,22.02 arc-90 4.29,22.07 L4.P$1
N$15_N
  Top 0.203: SV2.P$6 21.55,14.66 21.24,14.97 21.24,16.86 20.24,17.86 20.24,19.55 20.81,20.12 C23.1
N$15_P
  Top 0.203: SV2.P$4 20.55,14.68 20.83,14.97 20.83,16.69 19.83,17.69 19.83,19.64 C27.1
N$17_N
  Top 0.203: SV2.P$9 23.05,14.81 22.77,15.09 22.77,17.4 C24.1
N$17_P
  Top 0.203: SV2.P$7 22.05,14.79 22.36,15.09 22.36,18.29 C28.1
N$18
  Top 0.406: 6.05,24.58 IC1.1 3.08,24.57 arc-90 C15.1
N$19_N
  Top 0.203: SV2.P$12 24.55,14.72 24.26,15.01 24.26,15.58 25.83,17.15 26.93,17.15 27.63,17.86 27.63,18.44 C25.1
N$19_P
  Top 0.203: SV2.P$10 23.55,14.7 23.86,15.01 23.86,15.75 25.66,17.56 26.76,17.56 27.22,18.02 27.22,18.44 C29.1
RST  (via drill 0.36)
  Top 0.254: 40.63,20.92 SV1.5 41.07,20.92 42.3,22.14 42.3,27.93 42.53,28.16 IC2.P$19 | 35.88,3.41 S1.P$2
  Top 0.305: v35.88,4.54 35.88,3.41
  Bottom 0.254: SV1.5 37.81,20.92
  Bottom 0.305: 37.81,20.92 34.87,17.98 34.87,5.56 v35.88,4.54
SCK
  Top 0.254: IC2.P$17 43.14,29.15 42.26,29.15 41.43,28.33 41.43,26.52 40.91,26 SV1.3
SCLK  (via drill 0.36)
  Top 0.254: IC3.31 46.03,34.77 46.18,34.61 48.13,34.61 48.38,34.11 48.38,31.87 48.13,31.41 v48.09,31.41 45.89,31.41 45.68,31.2 45.68,30.69 IC2.P$12 | SIG_IN.2 SIG_OUT.2
  Bottom 0.254: v48.09,31.41 48.09,30.56 48.85,29.8 48.85,20.53 48.66,20.34 46.91,18.59 46.91,15.04 46.91,13.34 SIG_OUT.2
SIN  (via drill 0.36)
  Top 0.254: IC2.P$11 | IC3.32 48.08,35.38 48.79,35.38 48.84,34.96 48.84,31.27 48.84,30.89 v48.81,30.86 48.61,30.66 IC2.P$11 | IC2.P$11 48.6,30.66 | v49.08,19.59 44.08,14.59 SIG_IN.1
  Bottom 0.254: v49.08,19.59 49.38,19.89 49.38,30.32 48.84,30.86 v48.81,30.86
SOUT  (via drill 0.36)
  Top 0.254: IC3.25 43.02,35.38 40.79,35.38 36.8,31.39 v36.8,17.71 | v41.09,12.87 41.52,13.3 47.63,13.3 48.2,13.88 SIG_OUT.1
  Bottom 0.254: v36.8,17.71 36.8,13.56 37.48,12.87 v41.09,12.87
VIN
  Top 0.305: C9.1 20.15,42.75
  Top 0.406: FB3.2 C9.1 C12.1 | SV3.P$7 SV3.P$5 24.43,42.75 | SV3.P$6 SV3.P$4 24.43,41.87 24.43,42.75 | 20.15,42.75 24.43,42.75
XLAT  (via drill 0.36)
  Top 0.254: IC3.26 43.53,33.14 | IC2.P$14 44.65,31.22 44.51,31.36 44,31.36 43.82,31.54 43.81,31.54 43.53,31.82 43.53,33.14 | SIG_OUT.4 SIG_IN.4 | v42.55,31.66 43.53,32.64 43.53,33.14
  Bottom 0.254: v42.55,31.66 42.55,11.61 42.55,10.47 42.55,8.46 SIG_IN.4

### Text on the board
Dimension: DO NOT USE | DO NOT USE | DO NOT USE
tPlace: nullspacelabs.com | LED | ON/OFF | DP-EDP / Adapter V1.1 | UP | POWER | MO | C4 | DWN | MI | SCK | 3V3 | RST | charliex / mmca | GND | IN | OUT | POS | NEG | RESET | 20V | C2